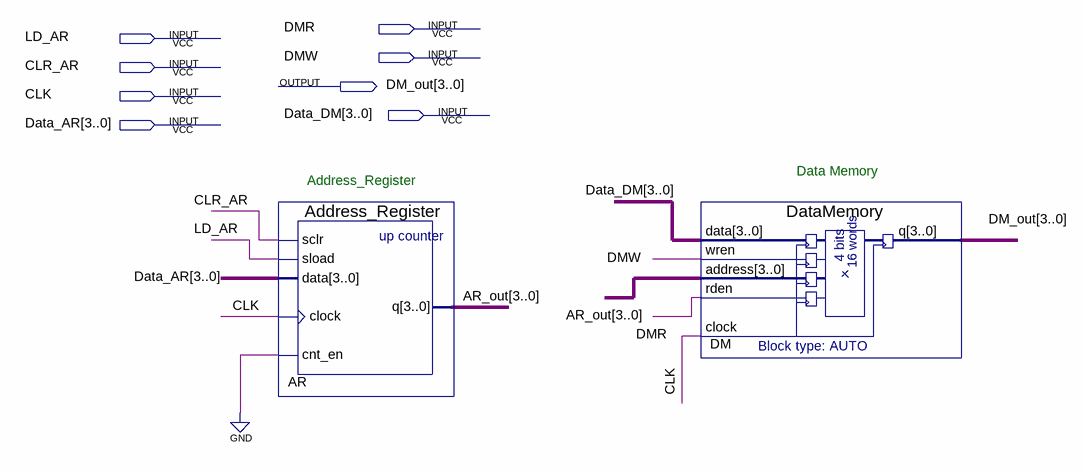
[diagram p0: schematic sheet]
// Quartus schematic 2019510083_Ata_Can_Yaymaci_DMU.bdf as structural Verilog: 2 symbols, 8 pins
module \2019510083_Ata_Can_Yaymaci_DMU  (
  input  DMR,
  input  LD_AR,
  input  DMW,
  input  CLR_AR,
  input  CLK,
  input  [3:0] Data_DM,
  input  [3:0] Data_AR,
  output [3:0] DM_out
);

  wire [3:0] AR_out;

  Address_Register AR (.sclr(CLR_AR), .sload(LD_AR), .data(Data_AR), .clock(CLK), .cnt_en(1'b0), .q(AR_out));
  DataMemory DM (.data(Data_DM), .wren(DMW), .address(AR_out), .rden(DMR), .clock(CLK), .q(DM_out));

  // Notes on the sheet:
  //   Data Memory
  //   Address_Register
endmodule
